# EAGLE design AnalogClock (EAGLE 7.5.0)
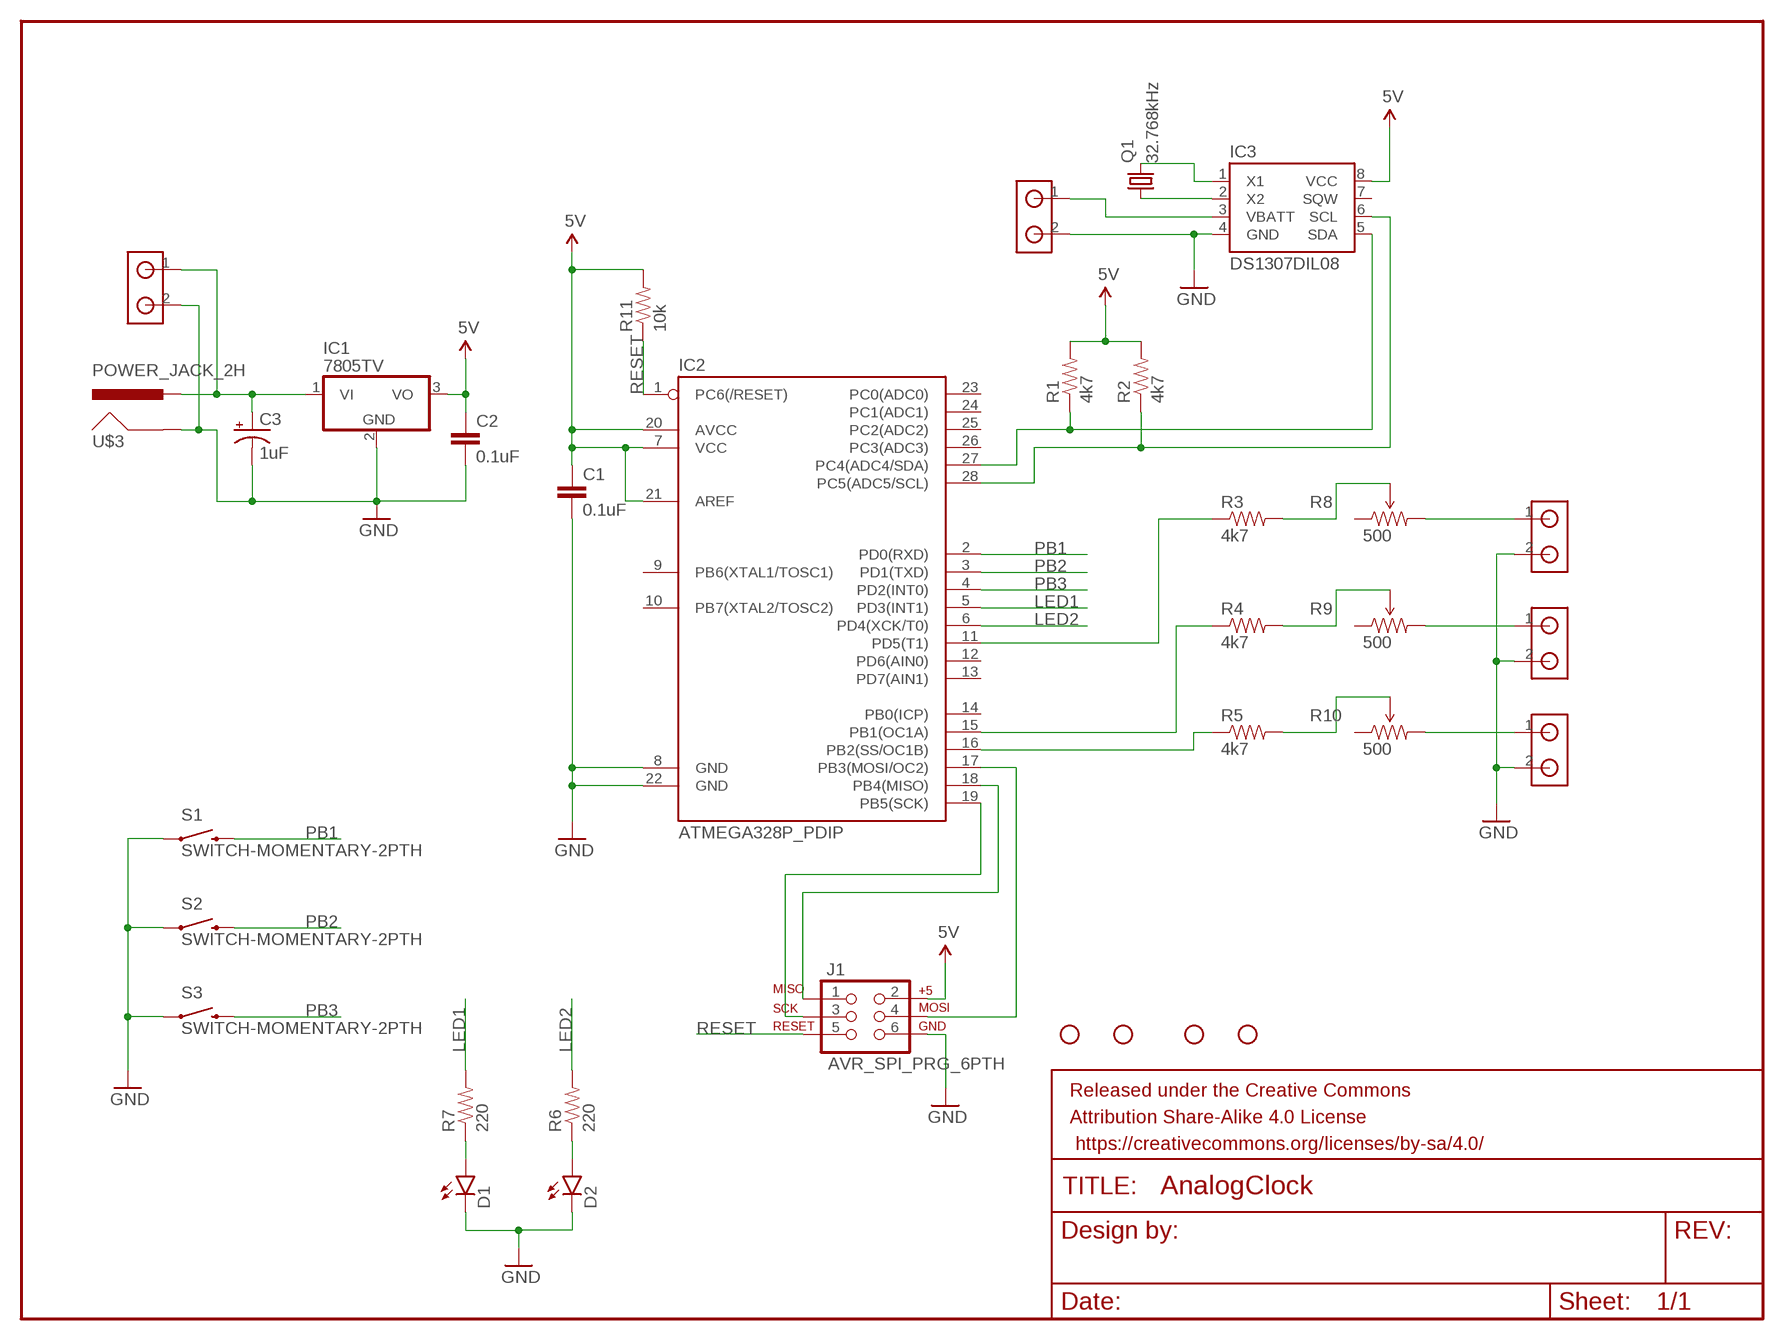
[diagram p0: schematic, sheet 1]

## Parts
C1  0.1uF  CAPPTH  [CAP-PTH-SMALL]
C2  0.1uF  CAPPTH  [CAP-PTH-SMALL]
C3  1uF  CAP_POLPTH2  [CPOL-RADIAL-10UF-25V]
D1  LED3MM  [LED3MM]
D2  LED3MM  [LED3MM]
FRAME1  FRAME-LETTERNO_PACKAGE  [DUMMY]
H1  STAND-OFF  [STAND-OFF]
H2  STAND-OFF  [STAND-OFF]
H3  STAND-OFF  [STAND-OFF]
H4  STAND-OFF  [STAND-OFF]
IC1  7805TV  [TO220V]
IC2  ATMEGA328P_PDIP  [DIL28-3]
IC3  DS1307DIL08  [DIL08]
J1  AVR_SPI_PRG_6PTH  [2X3]
Q1  32.768kHz  CRYSTALTC26V  [TC26V]
R1  4k7  RESISTORPTH-1/4W  [AXIAL-0.4]
R2  4k7  RESISTORPTH-1/4W  [AXIAL-0.4]
R3  4k7  RESISTORPTH-1/4W  [AXIAL-0.4]
R4  4k7  RESISTORPTH-1/4W  [AXIAL-0.4]
R5  4k7  RESISTORPTH-1/4W  [AXIAL-0.4]
R6  220  RESISTORPTH-1/4W  [AXIAL-0.4]
R7  220  RESISTORPTH-1/4W  [AXIAL-0.4]
R8  500  TRIMPOT  [TRIMPOT]
R9  500  TRIMPOT  [TRIMPOT]
R10  500  TRIMPOT  [TRIMPOT]
R11  10k  RESISTORPTH-1/4W  [AXIAL-0.4]
S1  SWITCH-MOMENTARY-2PTH  [TACTILE-PTH]
S2  SWITCH-MOMENTARY-2PTH  [TACTILE-PTH]
S3  SWITCH-MOMENTARY-2PTH  [TACTILE-PTH]
U$1  TBLOCK  [TBLOCK]
U$3  POWER_JACK_2H  [POWER_JACK_2H]
U$4  TBLOCK  [TBLOCK]
U$5  TBLOCK  [TBLOCK]
U$6  TBLOCK  [TBLOCK]
U$7  TBLOCK  [TBLOCK]

## Nets
5V: C1.1 C2.1 IC1.3(VO) IC2.7(VCC) IC2.20(AVCC) IC2.21(AREF) IC3.8(VCC) J1.2 R1.P$2 R2.P$2 R11.P$2
GND: C1.2 C2.2 C3.2(-) D1.K(C) D2.K(C) IC1.2(GND) IC2.8(GND) IC2.22(GND) IC3.4(GND) J1.6 S1.1 S2.1 S3.1 U$1.2 U$3.P$1(GND) U$4.2 U$5.2 U$6.2 U$7.2
LED1: IC2.5(PD3(INT1)) R7.P$2
LED2: IC2.6(PD4(XCK/T0)) R6.P$2
N$1: R3.P$2 R8.P$3(WIPER)
N$2: R4.P$2 R9.P$3(WIPER)
N$3: R5.P$2 R10.P$3(WIPER)
N$4: R8.P$2(CW) U$4.1
N$5: R9.P$2(CW) U$6.1
N$6: R10.P$2(CW) U$7.1
N$7: C3.1(+) IC1.1(VI) U$3.P$2(PWR) U$5.1
N$8: IC2.19(PB5(SCK)) J1.3
N$9: IC2.27(PC4(ADC4/SDA)) IC3.5(SDA) R1.P$1
N$10: IC2.28(PC5(ADC5/SCL)) IC3.6(SCL) R2.P$1
N$11: IC2.11(PD5(T1)) R3.P$1
N$12: IC2.17(PB3(MOSI/OC2)) J1.4
N$13: IC2.18(PB4(MISO)) J1.1
N$14: IC3.1(X1) Q1.2
N$15: IC3.2(X2) Q1.1
N$16: IC3.3(VBATT) U$1.1
N$17: IC2.15(PB1(OC1A)) R4.P$1
N$18: IC2.16(PB2(SS/OC1B)) R5.P$1
N$25: D1.A R7.P$1
N$26: D2.A R6.P$1
PB1: IC2.2(PD0(RXD)) S1.3
PB2: IC2.3(PD1(TXD)) S2.3
PB3: IC2.4(PD2(INT0)) S3.3
RESET: IC2.1(PC6(/RESET)) J1.5 R11.P$1
Unconnected: IC2.9(PB6(XTAL1/TOSC1)) IC2.10(PB7(XTAL2/TOSC2)) IC2.12(PD6(AIN0)) IC2.13(PD7(AIN1)) IC2.14(PB0(ICP)) IC2.23(PC0(ADC0)) IC2.24(PC1(ADC1)) IC2.25(PC2(ADC2)) IC2.26(PC3(ADC3)) IC3.7(SQW) R8.P$1(CCW) R9.P$1(CCW) R10.P$1(CCW)

## Library data of the parts
C1 C2 = SparkFun-Capacitors:CAP: Capacitor Standard 0603 ceramic capacitor, and 0.1" leaded capacitor.
C3 = SparkFun-Capacitors:CAP_POL: Capacitor Polarized These are standard SMD and PTH capacitors. Normally 10uF, 47uF, and 100uF in electrolytic and tantalum varieties. Always verify the external diameter of the through hole cap, it varies with capacity, voltage, and manufacturer. The EIA devices should be standard.
D1 D2 = SparkFun-LED:LED: LEDs Standard schematic elements and footprints for 5mm, 3mm, 1206, and 0603 sized LEDs. 5mm - Spark Fun Electronics SKU : COM-00529 (and others); PROD_ID: DIO-08794
FRAME1 = SparkFun-Aesthetics:FRAME-LETTER: Schematic Frame Standard 8.5x11 US Letter frame; DESIGNER: Nobody; VERSION: v01
H1-H4 = SparkFun-Electromechanical:STAND-OFF: #4 Stand Off This is the mechanical footprint for a #4 phillips button head screw. Use the keepout ring to avoid running the screw head into surrounding components. SKU : PRT-00447
IC1 = linear:78*: Positive VOLTAGE REGULATOR Source: http://cache.national.com/ds/LM/LM78L05.pdf http://www.fairchildsemi.com/ds/LM/LM7805.pdf
IC2 = SparkFun-DigitalIC:ATMEGA328P_PDIP: uC used in the Arduino 32kb flash, 1k EEPROM, 2k SRAM This is the through-hole version of this chip.
IC3 = custom:DS1307: I2C real-time clock with battery backup.
J1 = SparkFun-Connectors:AVR_SPI_PRG_6: AVR ISP 6 Pin This is the reduced ISP connector for AVR programming. Common on Arduino. This footprint will take up less PCB space and can be used with a 10-pin to 6-pin adapter such as SKU: BOB-08508 **Special note about "TEST_POINT" package. The stop mask is on the top side, so if you want your programming test points to be on the bottom of your board, make sure to place this package on the bottom side of the board. This also ensure that the orientation to program from the bottom side will be correct.
Q1 = crystal:CRYSTAL: CRYSTAL; OC_FARNELL: unknown; OC_NEWARK: unknown
R1-R7 R11 = SparkFun-Resistors:RESISTOR: Resistor Basic schematic elements and footprints for 0603, 1206, and PTH resistors.
R8-R10 = custom:TRIMPOT
S1-S3 = SparkFun-Electromechanical:SWITCH-MOMENTARY-2: Various NO switches- pushbuttons, reed, etc; PROD_ID: SWCH-08441
U$1 U$4-U$7 = custom:TBLOCK
U$3 = custom:POWER_JACK_2H

## Board
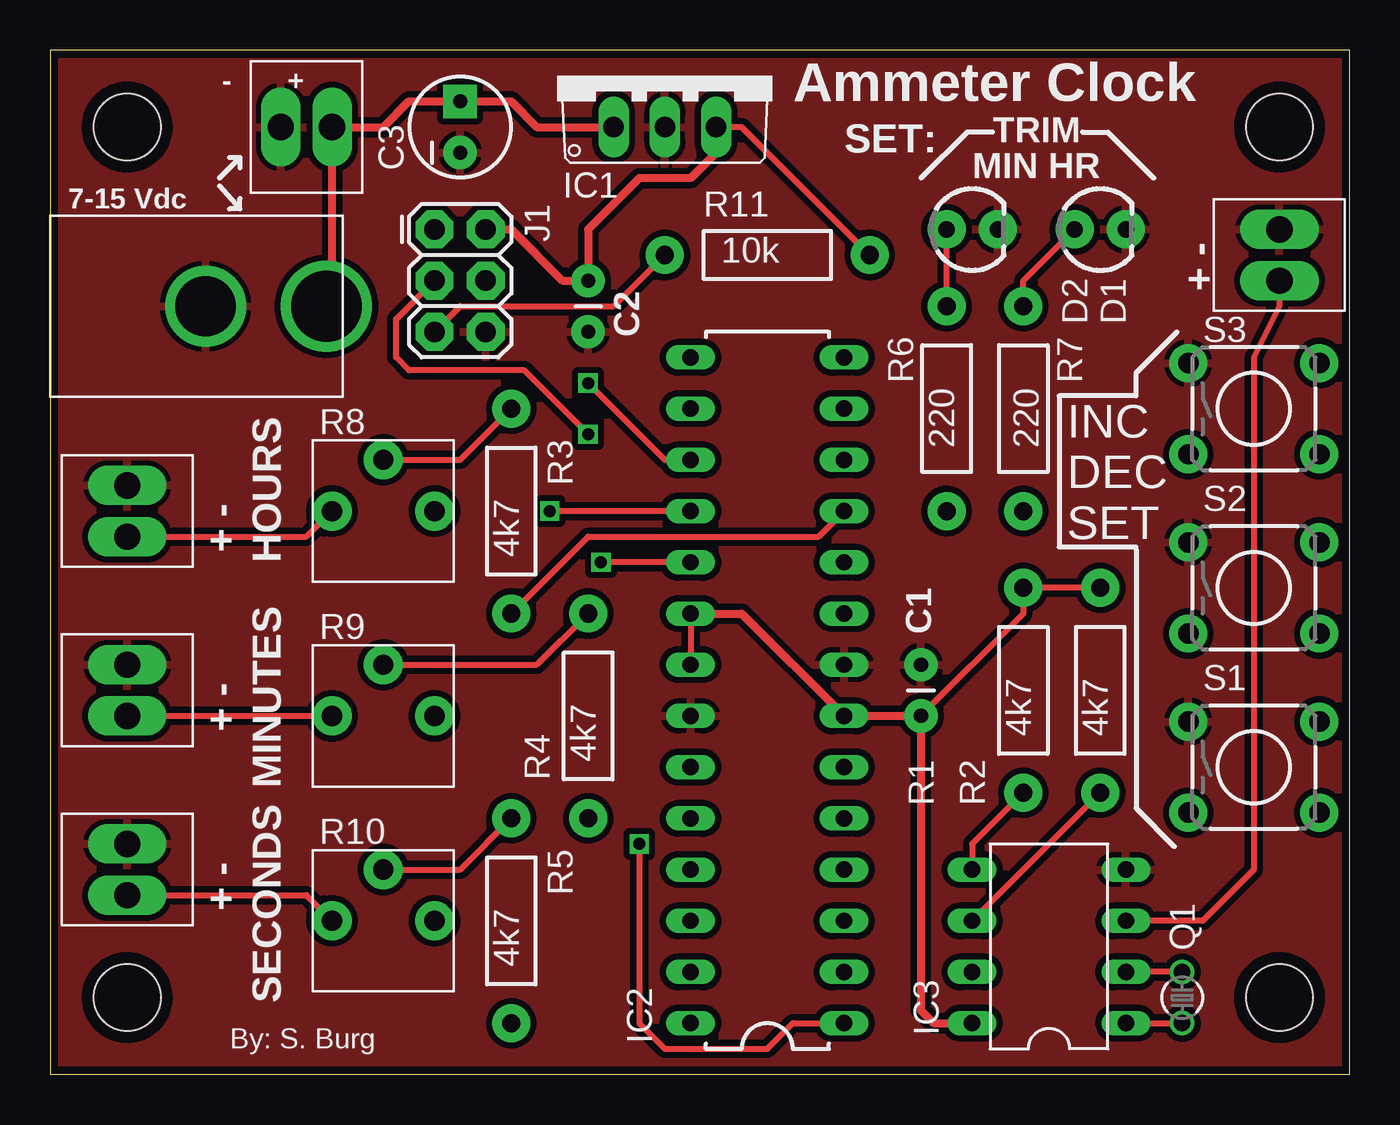
[diagram p1: board, top side]
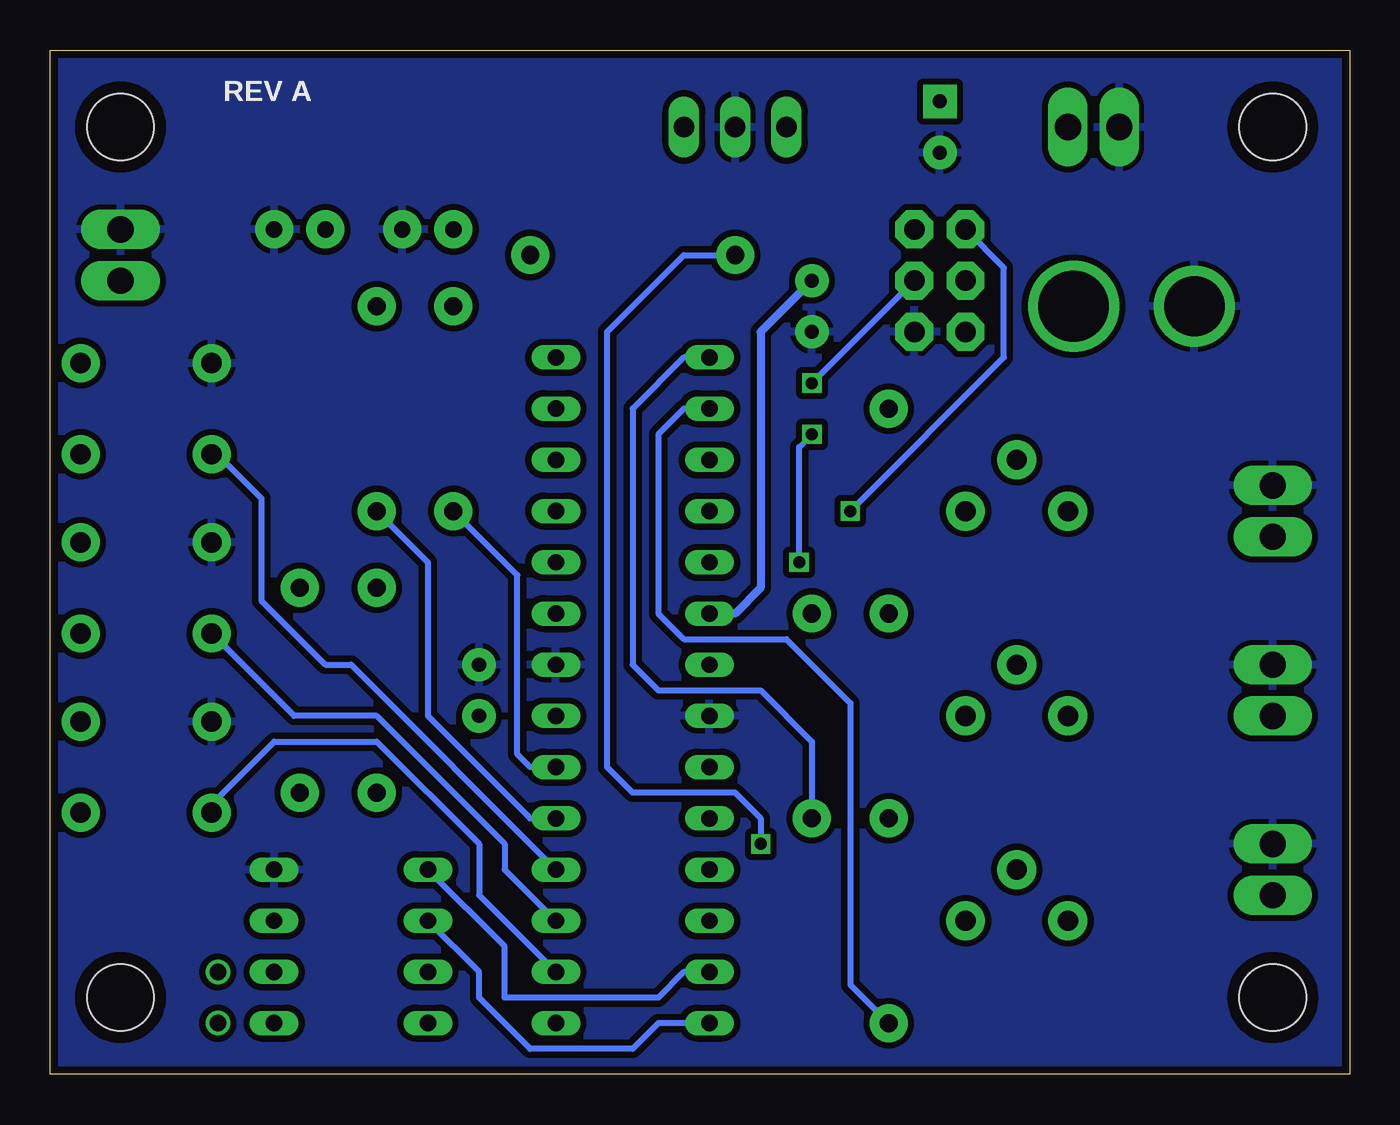
[diagram p2: board, bottom side, seen from below]

Size 64.44 x 50.79 mm. Coordinates in mm from the lower left corner, seen from the top.
Outline: 0,0 64.44,0 64.44,50.79 0,50.79 0,0
Copper layers (1*16): Top 0.0356mm / dielectric 1.5011mm / Bottom 0.0356mm
Design rules "oshpark-2layer": minimum track width 6mil, minimum drill 13mil, track to track 6mil, track to pad 6mil, pad to pad 6mil, via to via 6mil, smd to smd 6mil, copper to edge 15mil, drill to drill 6mil, minimum pad ring 7mil, minimum via ring 7mil, stop-mask expansion 2.5mil, vias tented up to drill 0mil, thermal gap 10mil

### Footprints (pad centres in the part's own frame; a part is rotated, then mirrored left to right if it is on the bottom)
CAP-PTH-SMALL = drill 0.7 pad 1.651: 1 0,0; 2 2.54,0
CPOL-RADIAL-10UF-25V = drill 0.7 pad 1.651 square: 1 1.27,0 | drill 0.7 pad 1.651: 2 -1.27,0
LED3MM = drill 0.813 pad 1.88: A -1.27,0; K 1.27,0
STAND-OFF = hole 3.302: 0,0
TO220V = drill 1.016 long: 1 -2.54,-2.54; 2 0,-2.54; 3 2.54,-2.54
DIL28-3 = drill 0.813 long: 1 -16.51,-3.81; 2 -13.97,-3.81; 3 -11.43,-3.81; 4 -8.89,-3.81; 5 -6.35,-3.81; 6 -3.81,-3.81; 7 -1.27,-3.81; 8 1.27,-3.81; 9 3.81,-3.81; 10 6.35,-3.81; 11 8.89,-3.81; 12 11.43,-3.81; 13 13.97,-3.81; 14 16.51,-3.81; 15 16.51,3.81; 16 13.97,3.81; 17 11.43,3.81; 18 8.89,3.81; 19 6.35,3.81; 20 3.81,3.81; 21 1.27,3.81; 22 -1.27,3.81; 23 -3.81,3.81; 24 -6.35,3.81; 25 -8.89,3.81; 26 -11.43,3.81; 27 -13.97,3.81; 28 -16.51,3.81
DIL08 = drill 0.813 long: 1 -3.81,-3.81; 2 -1.27,-3.81; 3 1.27,-3.81; 4 3.81,-3.81; 5 3.81,3.81; 6 1.27,3.81; 7 -1.27,3.81; 8 -3.81,3.81
2X3 = drill 1.016 pad 1.88 octagon: 1 0,0; 2 0,2.54; 3 2.54,0; 4 2.54,2.54; 5 5.08,0; 6 5.08,2.54
TC26V = drill 0.813: 1 -1.27,0; 2 1.27,0
AXIAL-0.4 = drill 0.9 pad 1.88: P$1 -5.08,0; P$2 5.08,0
TRIMPOT = drill 1 pad 1.93: P$1 2.54,0; P$2 -2.54,0; P$3 0,2.54
TACTILE-PTH = drill 1.016 pad 1.88: 1 -3.251,2.261; 2 3.251,2.261; 3 -3.251,-2.261; 4 3.251,-2.261
TBLOCK = drill 1.3 long: 1 -1.27,0; 2 1.27,0
POWER_JACK_2H = drill 3: P$1 7.696,0 | drill 3.5: P$2 13.691,0

### Placement (x,y rotation side)
C1  43.18,17.78 90 top
C2  26.67,39.37 270 top
C3  20.32,46.99 90 top
D1  52.07,41.91 0 top
D2  45.72,41.91 0 top
FRAME1  -21.59,77.47 0 top  (outside the outline)
H1  3.81,46.99 0 top
H2  3.81,3.81 0 top
H3  60.96,46.99 0 top
H4  60.96,3.81 0 top
IC1  30.48,49.53 0 top
IC2  35.56,19.05 90 top
IC3  49.53,6.35 90 top
J1  19.05,41.91 270 top
Q1  56.13,3.81 270 top
R1  48.26,19.05 90 top
R2  52.07,19.05 90 top
R3  22.86,27.94 90 top
R4  26.67,17.78 90 top
R5  22.86,7.62 90 top
R6  44.45,33.02 270 top
R7  48.26,33.02 270 top
R8  16.51,27.94 0 top
R9  16.51,17.78 0 top
R10  16.51,7.62 0 top
R11  35.56,40.64 0 top
S1  59.69,15.24 0 top
S2  59.69,24.13 0 top
S3  59.69,33.02 0 top
U$1  60.96,40.64 90 top
U$3  0,38.1 0 top
U$4  3.81,27.94 90 top
U$5  12.7,46.99 180 top
U$6  3.81,19.05 90 top
U$7  3.81,10.16 90 top

### Tracks (layer width: path | path; a pad name or v marks a point on that pad's centre or on a via)
5V
  Top 0.305: R11.P$2 34.29,46.99 IC1.3 | R2.P$2 R1.P$2 48.26,22.86 C1.1 | IC2.20 IC2.21
  Top 0.406: IC1.3 33.02,45.72 31.75,44.45 29.21,44.45 26.67,41.91 C2.1 25.4,39.37 22.86,41.91 J1.2 | IC2.20 34.29,22.86 IC2.7 C1.1 43.18,3.17 43.81,2.54 IC3.8
  Bottom 0.406: C2.1 29.21,36.83 29.21,24.13 30.48,22.86 IC2.20
GND
  pour Bottom (isolate 0.305): 0,0 64.77,0 64.77,50.8 0,50.8
  pour Top (isolate 0.305): 0,0 64.77,0 64.77,50.8 0,50.8
LED1
  Bottom 0.305: R7.P$2 45.72,25.4 45.72,17.78 40.64,12.7 IC2.5
LED2
  Bottom 0.305: IC2.6 40.64,15.24 41.27,15.88 41.27,24.77 R6.P$2
N$1
  Top 0.305: R8.P$3 20.32,30.48 R3.P$2
N$2
  Top 0.305: R9.P$3 24.13,20.32 R4.P$2
N$3
  Top 0.305: R10.P$3 20.32,10.16 R5.P$2
N$4
  Top 0.305: U$4.1 12.7,26.67 R8.P$2
N$5
  Top 0.305: U$6.1 R9.P$2
N$6
  Top 0.305: U$7.1 12.7,8.89 R10.P$2
N$7
  Top 0.406: U$3.P$2 13.97,38.1 U$5.1 16.51,46.99 17.78,48.26 C3.1 22.86,48.26 24.13,46.99 IC1.1
N$8  (via drill 0.6)
  Top 0.305: IC2.19 v27.3,25.4 | v26.67,31.75 23.5,34.92 17.78,34.92 17.14,35.56 17.14,37.47 J1.3
  Bottom 0.305: v27.3,25.4 27.3,31.11 v26.67,31.75
N$9
  Top 0.305: R1.P$1 45.72,11.43 IC3.5
  Bottom 0.305: IC2.27 33.02,5.08 34.29,3.81 41.91,3.81 41.91,6.35 IC3.5
N$10
  Top 0.305: R2.P$1 IC3.6
  Bottom 0.305: IC2.28 34.29,2.54 35.56,1.27 40.64,1.27 43.18,3.81 43.18,5.08 IC3.6
N$11
  Top 0.305: R3.P$1 26.67,26.67 38.1,26.67 IC2.11
N$12  (via drill 0.6)
  Top 0.305: IC2.17 30.48,30.48 v26.67,34.29
  Bottom 0.305: v26.67,34.29 J1.4
N$13  (via drill 0.6)
  Top 0.305: IC2.18 v24.77,27.94
  Bottom 0.305: v24.77,27.94 17.14,35.56 17.14,40.01 J1.1
N$14
  Top 0.305: IC3.1 Q1.2
N$15
  Top 0.305: Q1.1 IC3.2
N$16
  Top 0.305: U$1.1 60.96,38.1 59.69,35.56 59.69,10.16 57.15,7.62 IC3.3
N$17
  Bottom 0.305: IC2.15 33.02,35.56 35.56,33.02 35.56,20.32 34.29,19.05 29.21,19.05 26.67,16.51 R4.P$1
N$18
  Bottom 0.305: IC2.16 33.02,33.02 34.29,31.75 34.29,22.86 33.02,21.59 27.94,21.59 24.77,18.41 24.77,4.45 R5.P$1
N$25
  Top 0.305: R7.P$1 48.26,39.37 D1.A
N$26
  Top 0.305: R6.P$1 D2.A
PB1
  Bottom 0.305: S1.3 56.44,13.41 53.34,16.51 48.26,16.51 43.18,11.43 43.18,8.89 IC2.2
PB2
  Bottom 0.305: S2.3 52.35,17.78 48.26,17.78 41.91,11.43 41.91,10.16 IC2.3
PB3
  Bottom 0.305: S3.3 56.16,30.76 53.98,28.57 53.98,23.5 50.8,20.32 49.53,20.32 IC2.4
RESET  (via drill 0.6)
  Top 0.305: IC2.1 36.83,2.54 35.56,1.27 30.48,1.27 29.21,2.54 v29.21,11.43 | J1.5 20.32,38.1 27.94,38.1 R11.P$1
  Bottom 0.305: R11.P$1 33.02,40.64 36.83,36.83 36.83,15.24 35.56,13.97 30.48,13.97 29.21,12.7 v29.21,11.43

### Text on the board
tPlace: - + | Ammeter Clock | SET: | TRIM | MIN HR | 7-15 Vdc | + - | INC / DEC / SET | + - | HOURS | + - | MINUTES | + - | SECONDS | By: S. Burg
bPlace: REV A